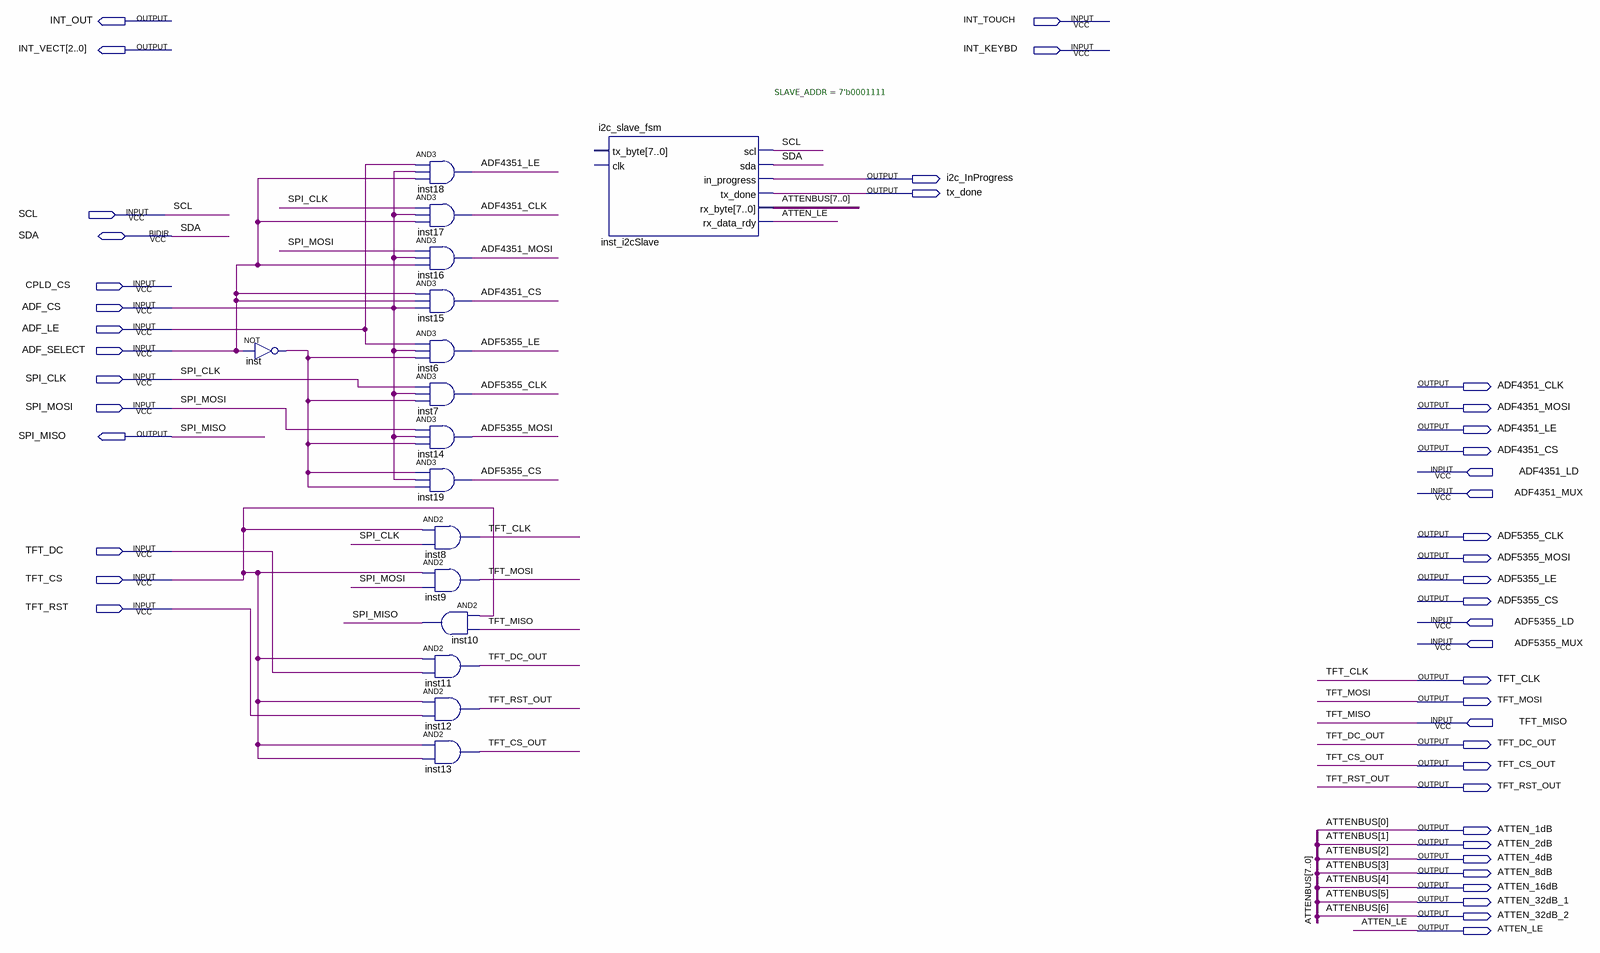
[diagram p0: schematic sheet]
// Quartus schematic ARSG_GlueLogic.bdf as structural Verilog: 16 symbols, 44 pins
module ARSG_GlueLogic (
  input  INT_TOUCH,
  input  INT_KEYBD,
  input  SCL,
  input  CPLD_CS,
  input  ADF_CS,
  input  ADF_LE,
  input  ADF_SELECT,
  input  SPI_CLK,
  input  SPI_MOSI,
  input  ADF4351_LD,
  input  ADF4351_MUX,
  input  TFT_DC,
  input  TFT_CS,
  input  TFT_RST,
  input  ADF5355_LD,
  input  ADF5355_MUX,
  input  TFT_MISO,
  inout  SDA,
  output INT_OUT,
  output [2:0] INT_VECT,
  output i2c_InProgress,
  output tx_done,
  output ADF4351_CLK,
  output ADF4351_MOSI,
  output ADF4351_LE,
  output SPI_MISO,
  output ADF4351_CS,
  output ADF5355_CLK,
  output ADF5355_MOSI,
  output ADF5355_LE,
  output ADF5355_CS,
  output TFT_CLK,
  output TFT_MOSI,
  output TFT_DC_OUT,
  output TFT_CS_OUT,
  output TFT_RST_OUT,
  output ATTEN_1dB,
  output ATTEN_2dB,
  output ATTEN_4dB,
  output ATTEN_8dB,
  output ATTEN_16dB,
  output ATTEN_32dB_1,
  output ATTEN_32dB_2,
  output ATTEN_LE
);

  wire inst_out;
  wire [7:7] ATTENBUS;

  not inst (inst_out, ADF_SELECT);
  and inst18 (ADF4351_LE, ADF_LE, ADF_CS, ADF_SELECT);
  and inst17 (ADF4351_CLK, SPI_CLK, ADF_CS, ADF_SELECT);
  and inst16 (ADF4351_MOSI, SPI_MOSI, ADF_CS, ADF_SELECT);
  and inst15 (ADF4351_CS, ADF_SELECT, ADF_SELECT, ADF_CS);
  and inst6 (ADF5355_LE, ADF_LE, ADF_CS, inst_out);
  and inst7 (ADF5355_CLK, SPI_CLK, ADF_CS, inst_out);
  and inst14 (ADF5355_MOSI, SPI_MOSI, ADF_CS, inst_out);
  and inst19 (ADF5355_CS, inst_out, ADF_CS, inst_out);
  and inst8 (TFT_CLK, TFT_CS, SPI_CLK);
  and inst9 (TFT_MOSI, TFT_CS, SPI_MOSI);
  and inst10 (SPI_MISO, TFT_CS, TFT_MISO);
  and inst11 (TFT_DC_OUT, TFT_CS, TFT_DC);
  and inst12 (TFT_RST_OUT, TFT_CS, TFT_RST);
  and inst13 (TFT_CS_OUT, TFT_CS, TFT_CS);
  i2c_slave_fsm #(.SLAVE_ADDR(7'b0001111)) inst_i2cSlave (
    .in_progress(i2c_InProgress), .tx_done(tx_done),
    .rx_byte({ATTENBUS[7], ATTEN_32dB_2, ATTEN_32dB_1, ATTEN_16dB, ATTEN_8dB, ATTEN_4dB, ATTEN_2dB, ATTEN_1dB}),
    .rx_data_rdy(ATTEN_LE), .scl(SCL), .sda(SDA));  // open: tx_byte, clk

  // Other names for the same wires on the sheet: ATTENBUS[6:0] = {ATTEN_32dB_2, ATTEN_32dB_1, ATTEN_16dB, ATTEN_8dB, ATTEN_4dB, ATTEN_2dB, ATTEN_1dB}
endmodule
